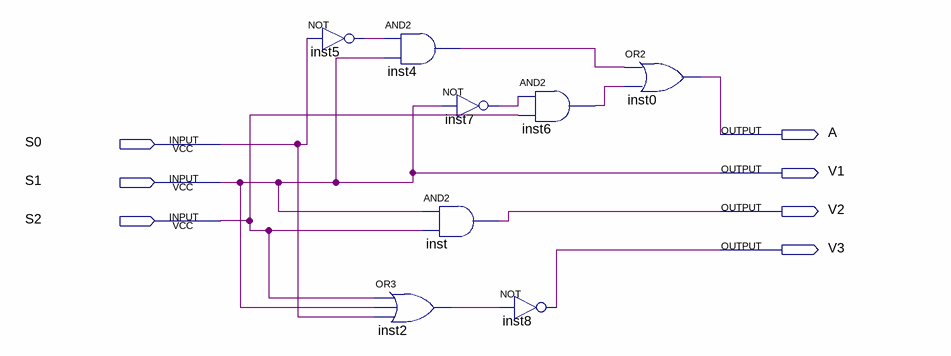
[diagram p0: schematic sheet]
// Quartus schematic aula02.bdf as structural Verilog: 8 symbols, 7 pins
module aula02 (
  input  S0,
  input  S1,
  input  S2,
  output A,
  output V1,
  output V2,
  output V3
);

  wire inst2_out, inst4_out, inst5_out, inst6_out, inst7_out;

  not inst5 (inst5_out, S0);
  or inst2 (inst2_out, S2, S1, S0);
  and inst4 (inst4_out, inst5_out, S1);
  not inst7 (inst7_out, S1);
  and inst (V2, S1, S2);
  and inst6 (inst6_out, inst7_out, S2);
  not inst8 (V3, inst2_out);
  or inst0 (A, inst4_out, inst6_out);

  assign V1 = S1;
endmodule
